# Altium project Atlas-V1.0.PrjPcb
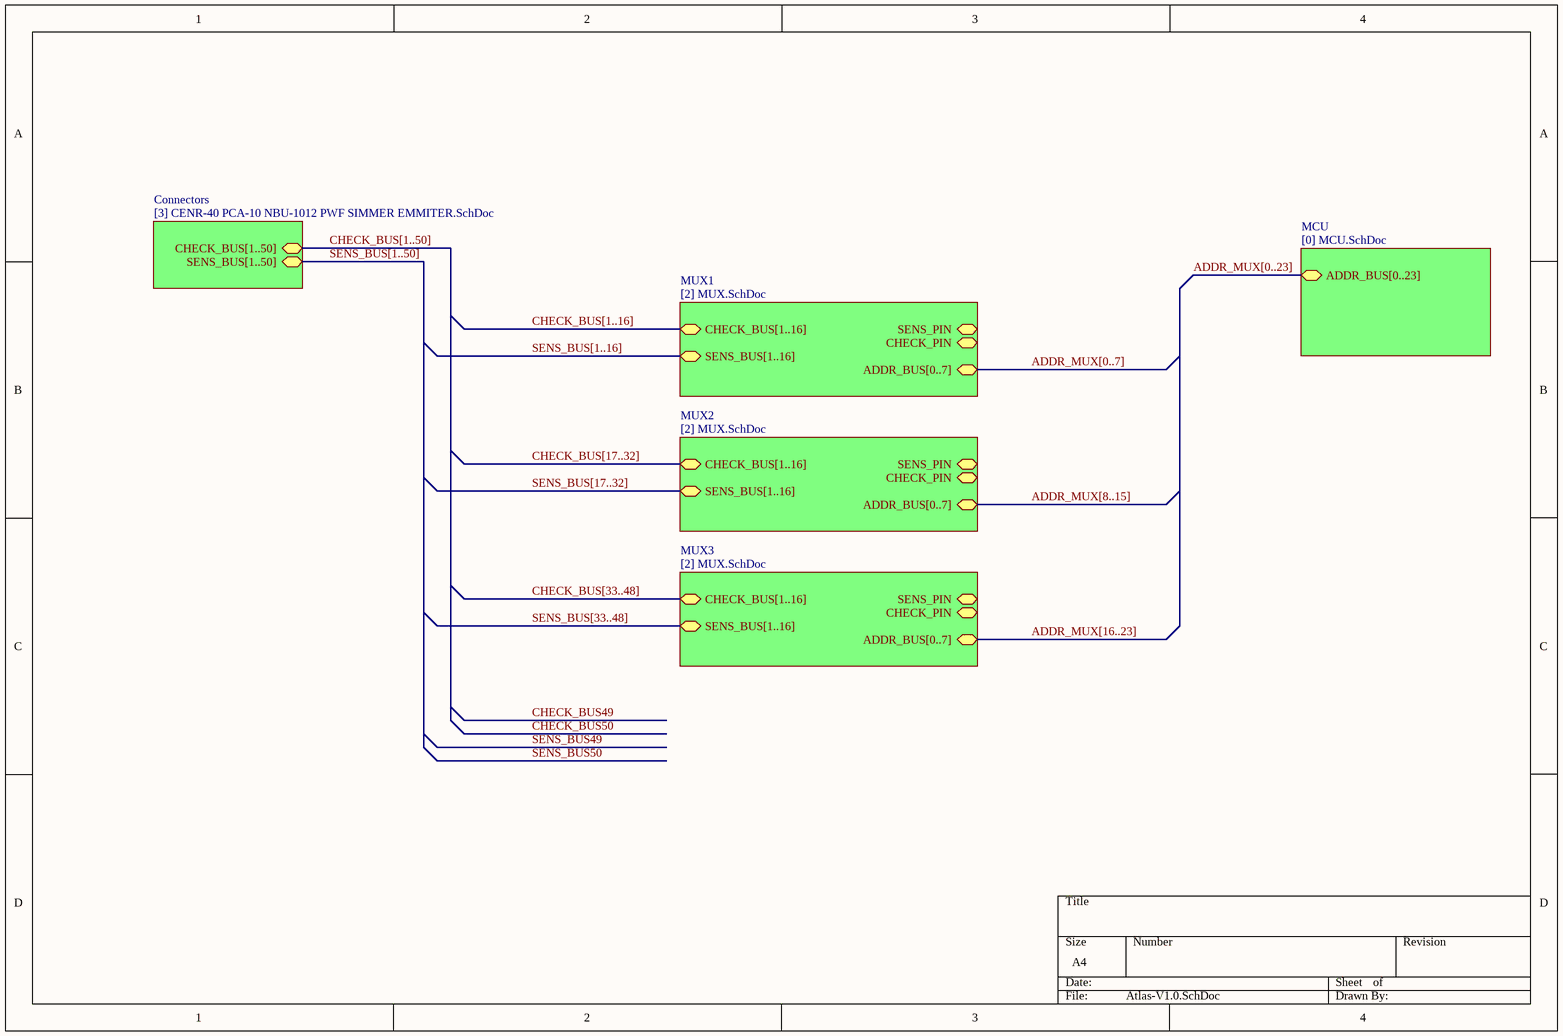
[diagram p0: Atlas-V1.0.SchDoc]
4 sheets, 19 parts. Net scope: hierarchical (ports join the sheet entries above them; power ports are global).
Board file: Atlas-PCB-V1.0.PcbDoc
Sheets:
  Atlas-V1.0.SchDoc
    Connectors = [3] CENR-40 PCA-10 NBU-1012 PWF SIMMER EMMITER.SchDoc
    MUX1 = [2] MUX.SchDoc
    MUX2 = [2] MUX.SchDoc
    MUX3 = [2] MUX.SchDoc
    MCU = [0] MCU.SchDoc

## Sheet Atlas-V1.0.SchDoc
size A4

### Sub-sheets
Connectors = [3] CENR-40 PCA-10 NBU-1012 PWF SIMMER EMMITER.SchDoc: CHECK_BUS[1..50], SENS_BUS[1..50]
MCU = [0] MCU.SchDoc: ADDR_BUS[0..23]
MUX1 = [2] MUX.SchDoc: SENS_BUS[1..16], CHECK_PIN, CHECK_BUS[1..16], SENS_PIN, ADDR_BUS[0..7]
MUX2 = [2] MUX.SchDoc: SENS_BUS[1..16], CHECK_PIN, CHECK_BUS[1..16], SENS_PIN, ADDR_BUS[0..7]
MUX3 = [2] MUX.SchDoc: SENS_BUS[1..16], CHECK_PIN, CHECK_BUS[1..16], SENS_PIN, ADDR_BUS[0..7]

### Buses and harness runs
bus ADDR_MUX[0..7] = sheet MUX1/ADDR_BUS[0..7]
bus ADDR_MUX[0..23] = sheet MCU/ADDR_BUS[0..23]
bus ADDR_MUX[8..15] = sheet MUX2/ADDR_BUS[0..7]
bus ADDR_MUX[16..23] = sheet MUX3/ADDR_BUS[0..7]
bus CHECK_BUS[1..16] = sheet MUX1/CHECK_BUS[1..16]
bus CHECK_BUS[1..50] = sheet Connectors/CHECK_BUS[1..50]
bus CHECK_BUS[17..32] = sheet MUX2/CHECK_BUS[1..16]
bus CHECK_BUS[33..48] = sheet MUX3/CHECK_BUS[1..16]
bus SENS_BUS[1..16] = sheet MUX1/SENS_BUS[1..16]
bus SENS_BUS[1..50] = sheet Connectors/SENS_BUS[1..50]
bus SENS_BUS[17..32] = sheet MUX2/SENS_BUS[1..16]
bus SENS_BUS[33..48] = sheet MUX3/SENS_BUS[1..16]

## Sheet [3] CENR-40 PCA-10 NBU-1012 PWF SIMMER EMMITER.SchDoc
size A4
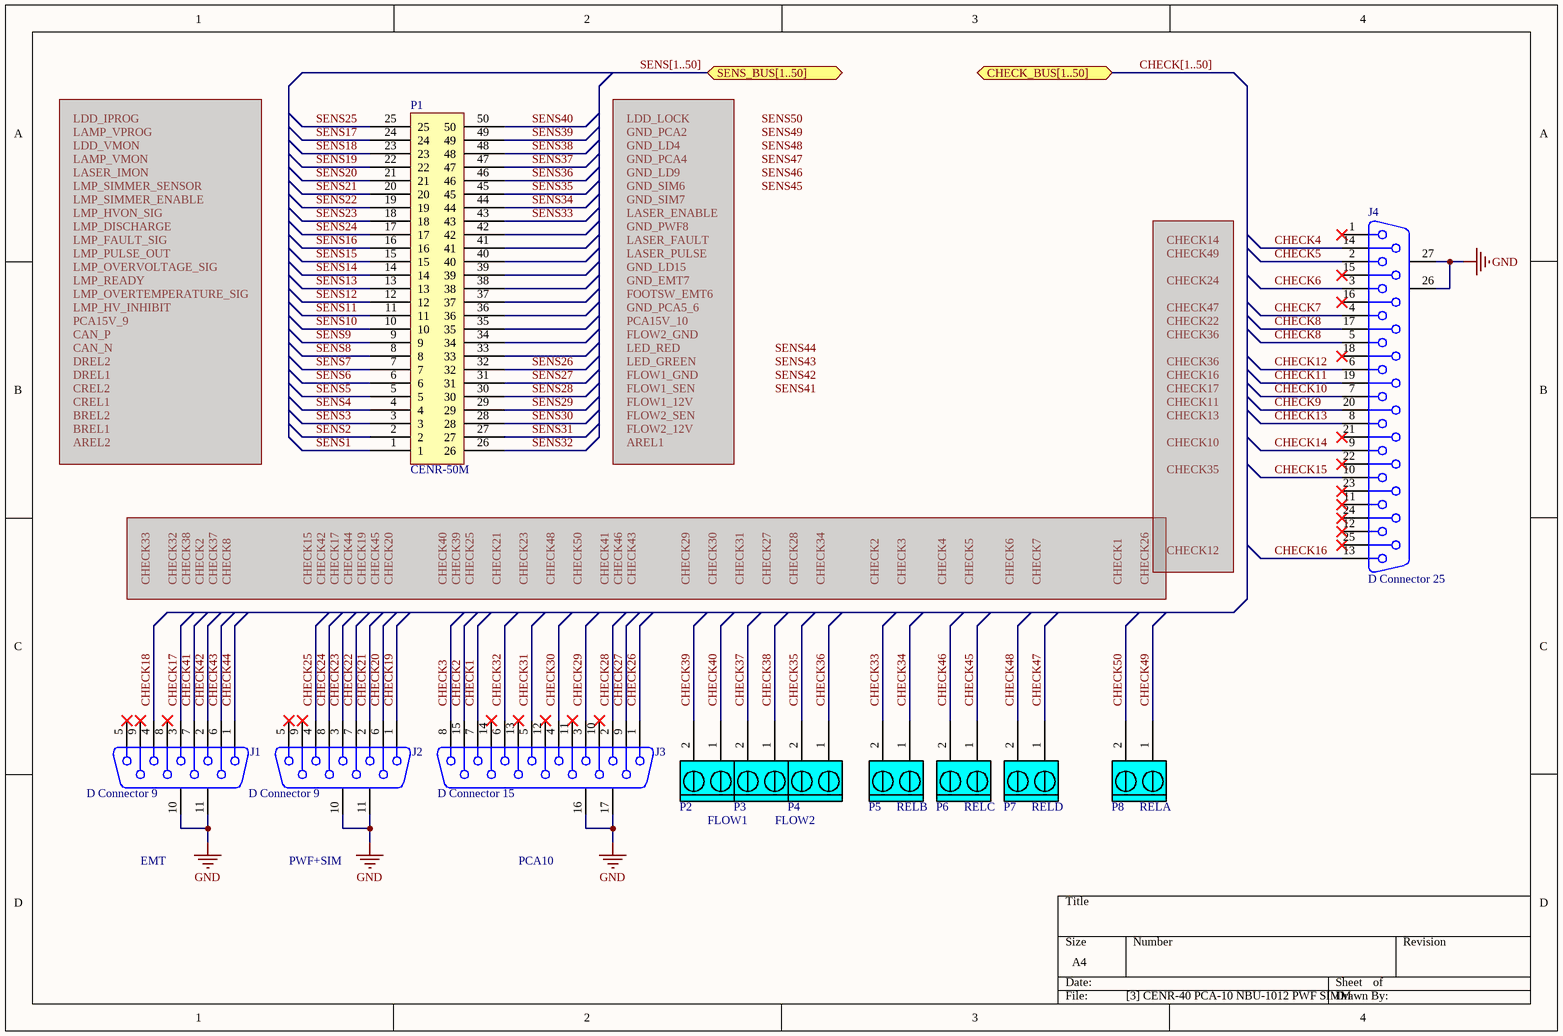
[diagram p1: [3] CENR-40 PCA-10 NBU-1012 PWF SIMMER EMMITER.SchDoc]

### Parts
J1  D Connector 9  [DSUB1.385-2H9F]
J2  D Connector 9  [DSUB1.385-2H9M]
J3  D Connector 15  [DSUB1.385-2H15M]
J4  D Connector 25  [DSUB1.385-2H25A-F]
P1  CENR-50M  [CENR-50M]
P2  DG340-3.81  [DG340-3.81-02P-00A(H)]  (value not drawn)
P3  DG340-3.81  [DG340-3.81-02P-00A(H)]  (value not drawn)
P4  DG340-3.81  [DG340-3.81-02P-00A(H)]  (value not drawn)
P5  DG340-3.81  [DG340-3.81-02P-00A(H)]  (value not drawn)
P6  DG340-3.81  [DG340-3.81-02P-00A(H)]  (value not drawn)
P7  DG340-3.81  [DG340-3.81-02P-00A(H)]  (value not drawn)
P8  DG340-3.81  [DG340-3.81-02P-00A(H)]  (value not drawn)

### Ports
CHECK_BUS[1..50], SENS_BUS[1..50]

### Nets
GND: J1.10(MH1) J1.11(MH2) J2.10(MH1) J2.11(MH2) J3.16(MH1) J3.17(MH2) J4.26(MH1) J4.27(MH2)
CHECK1: J3.7
CHECK2: J3.15
CHECK3: J3.8
CHECK4: J4.14
CHECK5: J4.2
CHECK6: J4.3
CHECK7: J4.4
CHECK8: J4.5 J4.17
CHECK9: J4.20
CHECK10: J4.7
CHECK11: J4.19
CHECK12: J4.6
CHECK13: J4.8
CHECK14: J4.9
CHECK15: J4.10
CHECK16: J4.13
CHECK17: J1.3  [project net CHECK1]
CHECK18: J1.4
CHECK19: J2.1
CHECK20: J2.6
CHECK21: J2.2
CHECK22: J2.7
CHECK23: J2.3
CHECK24: J2.8
CHECK25: J2.4
CHECK26: J3.1  [project net CHECK10]
CHECK27: J3.9  [project net CHECK11]
CHECK28: J3.2  [project net CHECK12]
CHECK29: J3.3  [project net CHECK13]
CHECK30: J3.4  [project net CHECK14]
CHECK31: J3.5  [project net CHECK15]
CHECK32: J3.6  [project net CHECK16]
CHECK33: P5.2  [project net CHECK1]
CHECK34: P5.1  [project net CHECK2]
CHECK35: P4.2  [project net CHECK3]
CHECK36: P4.1
CHECK37: P3.2
CHECK38: P3.1
CHECK39: P2.2
CHECK40: P2.1
CHECK41: J1.7
CHECK42: J1.2  [project net CHECK10]
CHECK43: J1.6  [project net CHECK11]
CHECK44: J1.1  [project net CHECK12]
CHECK45: P6.1  [project net CHECK13]
CHECK46: P6.2  [project net CHECK14]
CHECK47: P7.1  [project net CHECK15]
CHECK48: P7.2  [project net CHECK16]
CHECK49: P8.1
CHECK50: P8.2
SENS1: P1.1
SENS2: P1.2
SENS3: P1.3
SENS4: P1.4
SENS5: P1.5
SENS6: P1.6
SENS7: P1.7
SENS8: P1.8
SENS9: P1.9
SENS10: P1.10
SENS11: P1.11
SENS12: P1.12
SENS13: P1.13
SENS14: P1.14
SENS15: P1.15
SENS16: P1.16
SENS17: P1.24  [project net SENS1]
SENS18: P1.23
SENS19: P1.22
SENS20: P1.21
SENS21: P1.20
SENS22: P1.19
SENS23: P1.18
SENS24: P1.17
SENS25: P1.25
SENS26: P1.32  [project net SENS10]
SENS27: P1.31  [project net SENS11]
SENS28: P1.30  [project net SENS12]
SENS29: P1.29  [project net SENS13]
SENS30: P1.28  [project net SENS14]
SENS31: P1.27  [project net SENS15]
SENS32: P1.26  [project net SENS16]
SENS33: P1.43  [project net SENS1]
SENS34: P1.44  [project net SENS2]
SENS35: P1.45  [project net SENS3]
SENS36: P1.46
SENS37: P1.47
SENS38: P1.48
SENS39: P1.49
SENS40: P1.50

Not connected (* = marked no-connect by the designer): J1 5* 8* 9*; J2 5* 9*; J3 10* 11* 12* 13* 14*; J4 1* 11* 12* 15* 16* 18* 21* 22* 23* 24* 25*; P1 33 34 35 36 37 38 39 40 41 42

### Buses and harness runs
bus CHECK[1..50] = port CHECK_BUS[1..50]
bus SENS[1..50] = port SENS_BUS[1..50]

### Notes on the sheet
- FLOW1
- FLOW2
- RELB
- RELC
- (near P7) RELD
- (near P8) RELA
- EMT
- PWF+SIM
- PCA10
- Labels drawn without touching a wire or pin: SENS41, SENS42, SENS43, SENS44, SENS45, SENS46, SENS47, SENS48, SENS49, SENS50

### Library data of the parts
J1 J2 = D Connector 9: Receptacle Assembly, 9 Position, Right Angle; PackageDocument: O; Positions: 9; Published: 15-Jun-2001; LatestRevisionDate: 17-Jul-2002; LatestRevisionNote: Re-released for DXP Platform.; DatasheetDocument: 1-Sep-1999; PackageReference: 788750; Publisher: Altium Limited; Orientation: Right Angle; Gender: Receptacle
J3 = D Connector 15: Receptacle Assembly, 15 Position, Right Angle; PackageDocument: O; Positions: 15; Published: 15-Jun-2001; LatestRevisionDate: 17-Jul-2002; LatestRevisionNote: Re-released for DXP Platform.; DatasheetDocument: 1-Sep-99; PackageReference: 788757; Publisher: Altium Limited; Orientation: Right Angle; Gender: Receptacle
J4 = D Connector 25: Receptacle Assembly, 25 Position, Right Angle; PackageDocument: U; Positions: 25; Published: 15-Jun-2001; LatestRevisionDate: 17-Jul-2002; LatestRevisionNote: Re-released for DXP Platform.; DatasheetDocument: 19-Mar-1999; PackageReference: 787202; Publisher: Altium Limited; Orientation: Right Angle; Gender: Receptacle
P2-P8 = DG340-3.81-02P: Terminal block

## Sheet [2] MUX.SchDoc
size A4
Used 3 times, as channels MUX1, MUX2, MUX3. Parts and nets are listed once, with the designators drawn on the sheet.
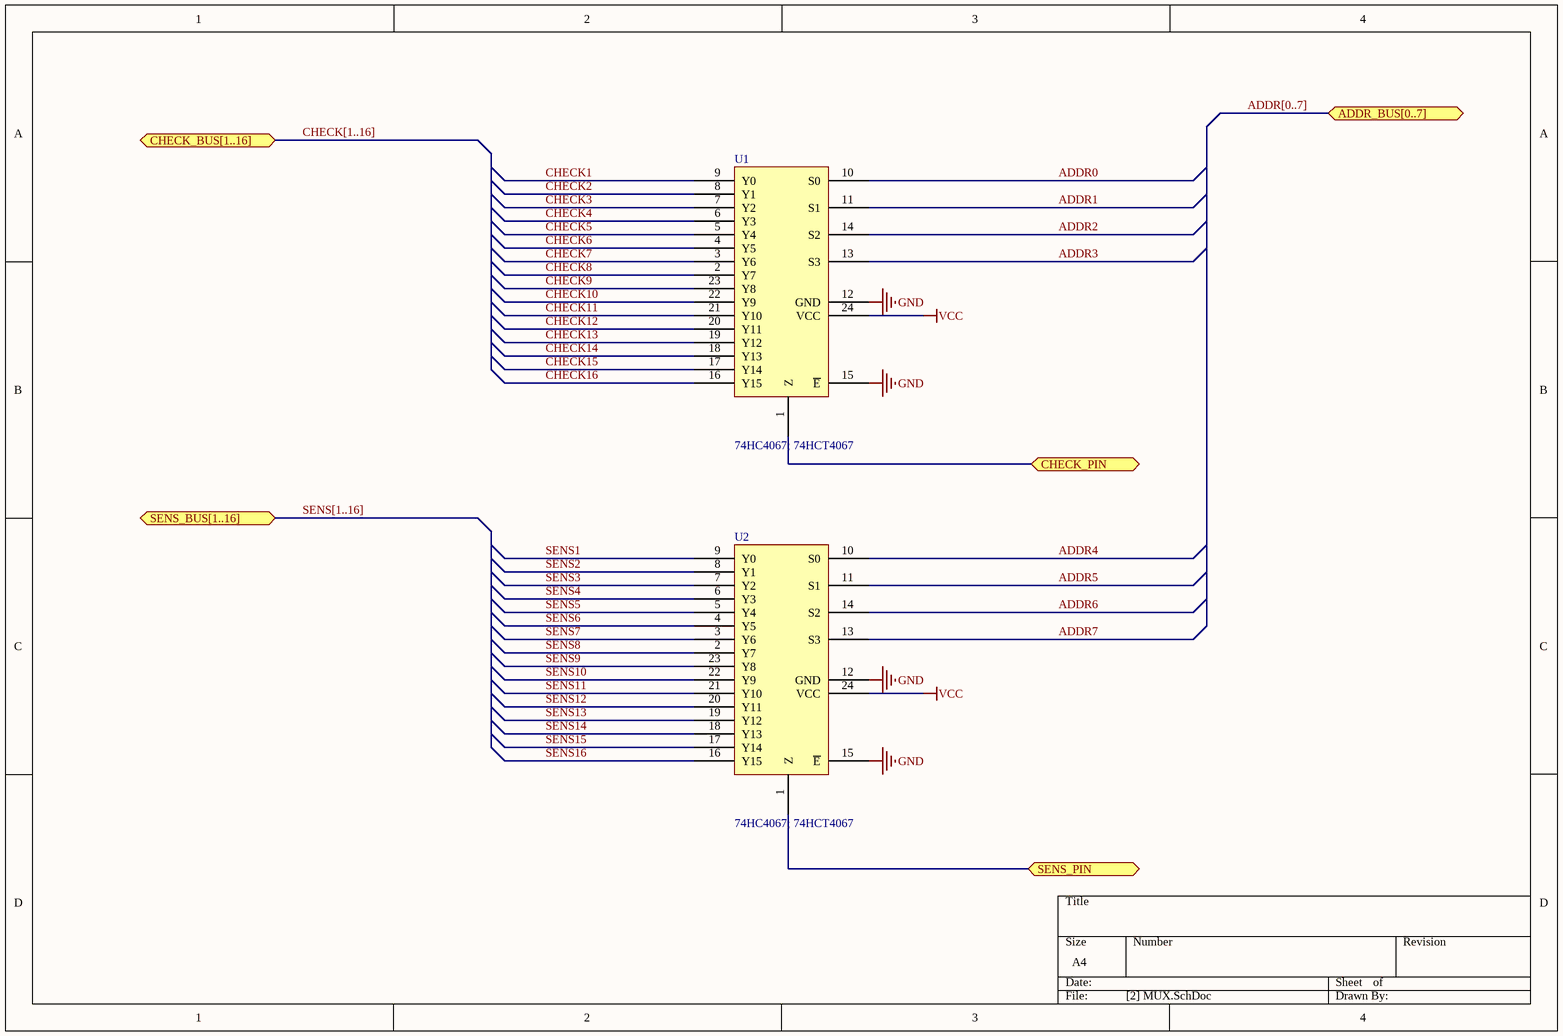
[diagram p2: [2] MUX.SchDoc]

### Parts
U1  74HC4067; 74HCT4067  [SO24]
U2  74HC4067; 74HCT4067  [SO24]

### Ports
ADDR_BUS[0..7], CHECK_BUS[1..16], CHECK_PIN, SENS_BUS[1..16], SENS_PIN

### Nets
GND: U1.12(GND) U1.15(~{E}) U2.12(GND) U2.15(~{E})
VCC: U1.24(VCC) U2.24(VCC)
ADDR0: U1.10(S0)
ADDR1: U1.11(S1)
ADDR2: U1.14(S2)
ADDR3: U1.13(S3)
ADDR4: U2.10(S0)
ADDR5: U2.11(S1)
ADDR6: U2.14(S2)
ADDR7: U2.13(S3)
CHECK1: U1.9(Y0)
CHECK2: U1.8(Y1)
CHECK3: U1.7(Y2)
CHECK4: U1.6(Y3)
CHECK5: U1.5(Y4)
CHECK6: U1.4(Y5)
CHECK7: U1.3(Y6)
CHECK8: U1.2(Y7)
CHECK9: U1.23(Y8)
CHECK10: U1.22(Y9)
CHECK11: U1.21(Y10)
CHECK12: U1.20(Y11)
CHECK13: U1.19(Y12)
CHECK14: U1.18(Y13)
CHECK15: U1.17(Y14)
CHECK16: U1.16(Y15)
CHECK_PIN: U1.1(Z) ; port CHECK_PIN
SENS1: U2.9(Y0)
SENS2: U2.8(Y1)
SENS3: U2.7(Y2)
SENS4: U2.6(Y3)
SENS5: U2.5(Y4)
SENS6: U2.4(Y5)
SENS7: U2.3(Y6)
SENS8: U2.2(Y7)
SENS9: U2.23(Y8)
SENS10: U2.22(Y9)
SENS11: U2.21(Y10)
SENS12: U2.20(Y11)
SENS13: U2.19(Y12)
SENS14: U2.18(Y13)
SENS15: U2.17(Y14)
SENS16: U2.16(Y15)
SENS_PIN: U2.1(Z) ; port SENS_PIN

### Channels
MUX1: designators end in _MUX1; ports CHECK_PIN=NetU1_MUX1_1 SENS_PIN=NetU2_MUX1_1
MUX2: designators end in _MUX2; ports CHECK_PIN=NetU1_MUX2_1 SENS_PIN=NetU2_MUX2_1
MUX3: designators end in _MUX3; ports CHECK_PIN=NetU1_MUX3_1 SENS_PIN=NetU2_MUX3_1

### Buses and harness runs
bus ADDR[0..7] = port ADDR_BUS[0..7]
bus CHECK[1..16] = port CHECK_BUS[1..16]
bus SENS[1..16] = port SENS_BUS[1..16]

### Library data of the parts
U1 U2 = 74HC4067; 74HCT4067: 16-channel analog multiplexer/demultiplexer

## Sheet [0] MCU.SchDoc
size A4
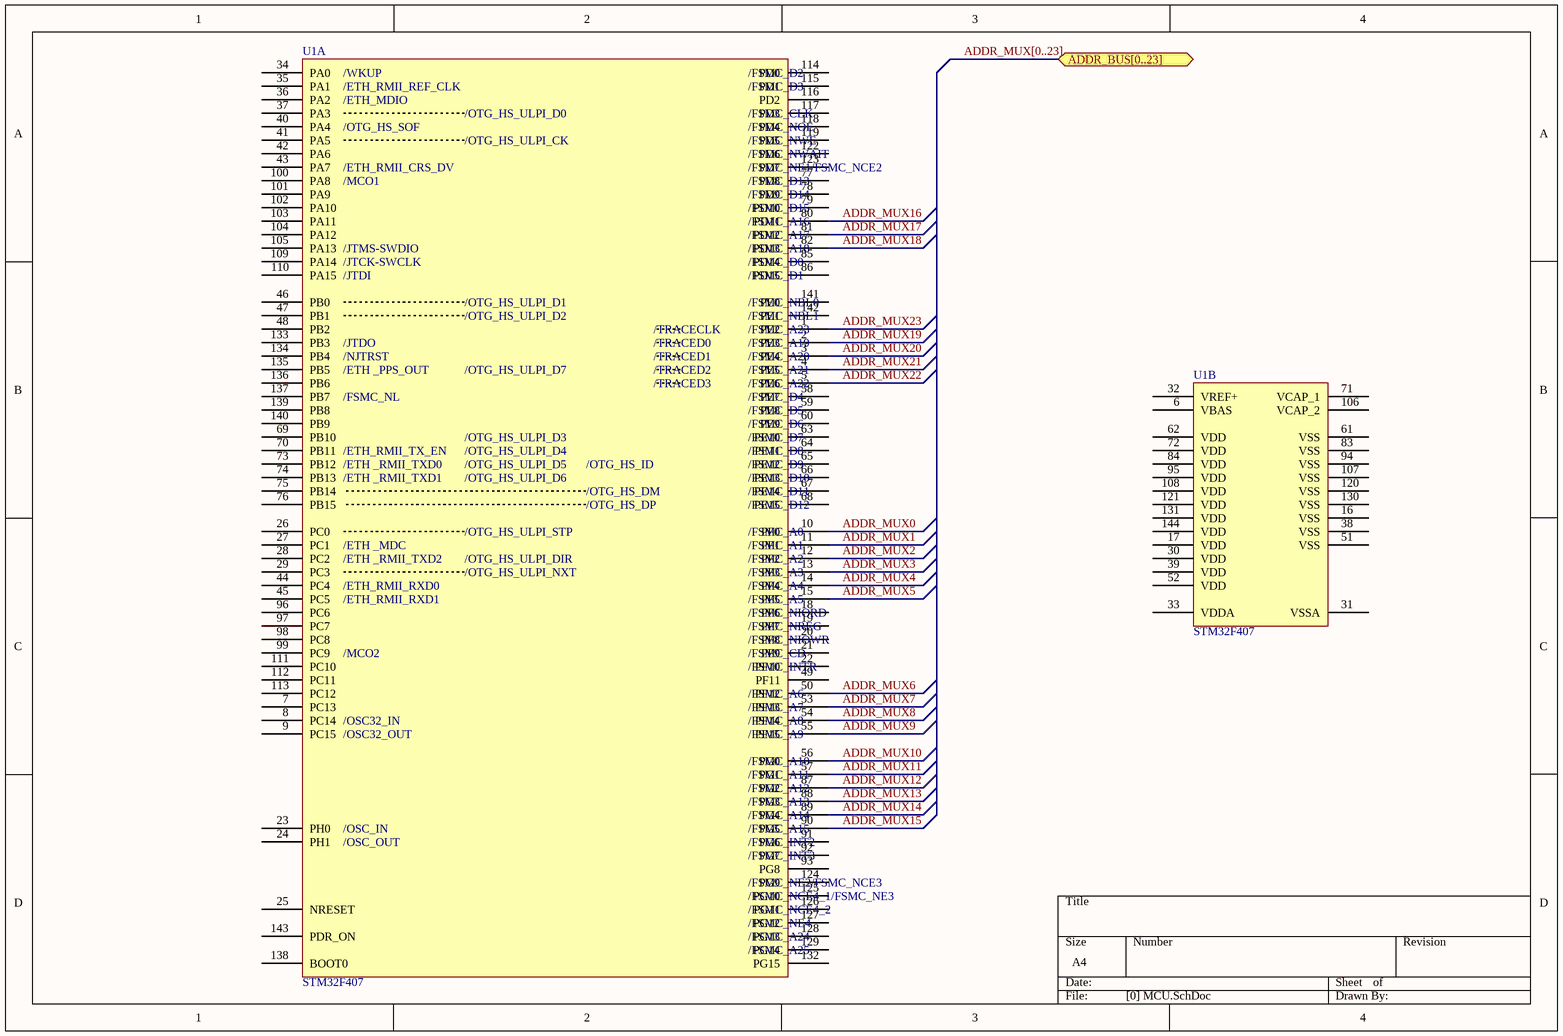
[diagram p3: [0] MCU.SchDoc]

### Parts
U1  STM32F407  [LQFP144]  (parts A,B of 2)

### Ports
ADDR_BUS[0..23]

### Nets
ADDR_MUX0: U1.10(PF0)  [project net ADDR0]
ADDR_MUX1: U1.11(PF1)  [project net ADDR1]
ADDR_MUX2: U1.12(PF2)  [project net ADDR2]
ADDR_MUX3: U1.13(PF3)  [project net ADDR3]
ADDR_MUX4: U1.14(PF4)  [project net ADDR4]
ADDR_MUX5: U1.15(PF5)  [project net ADDR5]
ADDR_MUX6: U1.50(PF12)  [project net ADDR6]
ADDR_MUX7: U1.53(PF13)  [project net ADDR7]
ADDR_MUX8: U1.54(PF14)  [project net ADDR0]
ADDR_MUX9: U1.55(PF15)  [project net ADDR1]
ADDR_MUX10: U1.56(PG0)  [project net ADDR2]
ADDR_MUX11: U1.57(PG1)  [project net ADDR3]
ADDR_MUX12: U1.87(PG2)  [project net ADDR4]
ADDR_MUX13: U1.88(PG3)  [project net ADDR5]
ADDR_MUX14: U1.89(PG4)  [project net ADDR6]
ADDR_MUX15: U1.90(PG5)  [project net ADDR7]
ADDR_MUX16: U1.80(PD11)  [project net ADDR0]
ADDR_MUX17: U1.81(PD12)  [project net ADDR1]
ADDR_MUX18: U1.82(PD13)  [project net ADDR2]
ADDR_MUX19: U1.2(PE3)  [project net ADDR3]
ADDR_MUX20: U1.3(PE4)  [project net ADDR4]
ADDR_MUX21: U1.4(PE5)  [project net ADDR5]
ADDR_MUX22: U1.5(PE6)  [project net ADDR6]
ADDR_MUX23: U1.1(PE2)  [project net ADDR7]

Not connected (* = marked no-connect by the designer): U1 6(VBAS) 7(PC13) 8(PC14) 9(PC15) 16(VSS) 17(VDD) 18(PF6) 19(PF7) 20(PF8) 21(PF9) 22(PF10) 23(PH0) 24(PH1) 25(NRESET) 26(PC0) 27(PC1) 28(PC2) 29(PC3) 30(VDD) 31(VSSA) 32(VREF+) 33(VDDA) 34(PA0) 35(PA1) 36(PA2) 37(PA3) 38(VSS) 39(VDD) 40(PA4) 41(PA5) 42(PA6) 43(PA7) 44(PC4) 45(PC5) 46(PB0) 47(PB1) 48(PB2) 49(PF11) 51(VSS) 52(VDD) 58(PE7) 59(PE8) 60(PE9) 61(VSS) 62(VDD) 63(PE10) 64(PE11) 65(PE12) 66(PE13) 67(PE14) 68(PE15) 69(PB10) 70(PB11) 71(VCAP_1) 72(VDD) 73(PB12) 74(PB13) 75(PB14) 76(PB15) 77(PD8) 78(PD9) 79(PD10) 83(VSS) 84(VDD) 85(PD14) 86(PD15) 91(PG6) 92(PG7) 93(PG8) 94(VSS) 95(VDD) 96(PC6) 97(PC7) 98(PC8) 99(PC9) 100(PA8) 101(PA9) 102(PA10) 103(PA11) 104(PA12) 105(PA13) 106(VCAP_2) 107(VSS) 108(VDD) 109(PA14) 110(PA15) 111(PC10) 112(PC11) 113(PC12) 114(PD0) 115(PD1) 116(PD2) 117(PD3) 118(PD4) 119(PD5) 120(VSS) 121(VDD) 122(PD6) 123(PD7) 124(PG9) 125(PG10) 126(PG11) 127(PG12) 128(PG13) 129(PG14) 130(VSS) 131(VDD) 132(PG15) 133(PB3) 134(PB4) 135(PB5) 136(PB6) 137(PB7) 138(BOOT0) 139(PB8) 140(PB9) 141(PE0) 142(PE1) 143(PDR_ON) 144(VDD)

### Buses and harness runs
bus ADDR_MUX[0..23] = port ADDR_BUS[0..23]

### Notes on the sheet
- (in symbol STM32F407ZGT6, part A) /WKUP; /FSMC_D2; /ETH_RMII_REF_CLK; /FSMC_D3; /ETH_MDIO; /OTG_HS_ULPI_D0; /FSMC_CLK; /OTG_HS_SOF; /FSMC_NOE; /OTG_HS_ULPI_CK; /FSMC_NWE; /FSMC_NWAIT; /ETH_RMII_CRS_DV; /FSMC_NE1/FSMC_NCE2; /MCO1; /FSMC_D13; /FSMC_D14; /FSMC_D15; /FSMC_A16; /FSMC_A17; /JTMS-SWDIO; /FSMC_A18; /JTCK-SWCLK; /FSMC_D0; /JTDI; /FSMC_D1; /OTG_HS_ULPI_D1; /FSMC_NBL0; /OTG_HS_ULPI_D2; /FSMC_NBL1; /TRACECLK; /FSMC_A23; /JTDO; /TRACED0; /FSMC_A19; /NJTRST; /TRACED1; /FSMC_A20; /ETH _PPS_OUT; /OTG_HS_ULPI_D7; /TRACED2; /FSMC_A21; /TRACED3; /FSMC_A22; /FSMC_NL; /FSMC_D4; /FSMC_D5; /FSMC_D6; /OTG_HS_ULPI_D3; /FSMC_D7; /ETH_RMII_TX_EN; /OTG_HS_ULPI_D4; /FSMC_D8; /ETH _RMII_TXD0; /OTG_HS_ULPI_D5; /OTG_HS_ID; /FSMC_D9; /ETH _RMII_TXD1; /OTG_HS_ULPI_D6; /FSMC_D10; /OTG_HS_DM; /FSMC_D11; /OTG_HS_DP; /FSMC_D12; /OTG_HS_ULPI_STP; /FSMC_A0; /ETH _MDC; /FSMC_A1; /ETH _RMII_TXD2; /OTG_HS_ULPI_DIR; /FSMC_A2; /OTG_HS_ULPI_NXT; /FSMC_A3; /ETH_RMII_RXD0; /FSMC_A4; /ETH_RMII_RXD1; /FSMC_A5; /FSMC_NIORD; /FSMC_NREG; /FSMC_NIOWR; /MCO2; /FSMC_CD; /FSMC_INTR; /FSMC_A6; /FSMC_A7; /OSC32_IN; /FSMC_A8; /OSC32_OUT; /FSMC_A9; /FSMC_A10; /FSMC_A11; /FSMC_A12; /FSMC_A13; /FSMC_A14; /OSC_IN; /FSMC_A15; /OSC_OUT; /FSMC_INT2; /FSMC_INT3; /FSMC_NE2/FSMC_NCE3; /FSMC_NCE4_1/FSMC_NE3; /FSMC_NCE4_2; /FSMC_NE4; /FSMC_A24; /FSMC_A25

### Library data of the parts
U1 = STM32F407ZGT6: ST Microcontroller ARM 32-bit Cortex M4

## Nets that join several sheets
GND: [3] CENR-40 PCA-10 NBU-1012 PWF SIMMER EMMITER (8 pins), MUX1 (U1_MUX1.12 U1_MUX1.15 U2_MUX1.12 U2_MUX1.15), MUX2 (U1_MUX2.12 U1_MUX2.15 U2_MUX2.12 U2_MUX2.15), MUX3 (U1_MUX3.12 U1_MUX3.15 U2_MUX3.12 U2_MUX3.15)
VCC: MUX1 (U1_MUX1.24 U2_MUX1.24), MUX2 (U1_MUX2.24 U2_MUX2.24), MUX3 (U1_MUX3.24 U2_MUX3.24)
ADDR0: MUX1 (U1_MUX1.10), [0] MCU (U1.10)
ADDR0: MUX2 (U1_MUX2.10), [0] MCU (U1.54)
ADDR0: MUX3 (U1_MUX3.10), [0] MCU (U1.80)
ADDR1: MUX1 (U1_MUX1.11), [0] MCU (U1.11)
ADDR1: MUX2 (U1_MUX2.11), [0] MCU (U1.55)
ADDR1: MUX3 (U1_MUX3.11), [0] MCU (U1.81)
ADDR2: MUX1 (U1_MUX1.14), [0] MCU (U1.12)
ADDR2: MUX2 (U1_MUX2.14), [0] MCU (U1.56)
ADDR2: MUX3 (U1_MUX3.14), [0] MCU (U1.82)
ADDR3: MUX1 (U1_MUX1.13), [0] MCU (U1.13)
ADDR3: MUX2 (U1_MUX2.13), [0] MCU (U1.57)
ADDR3: MUX3 (U1_MUX3.13), [0] MCU (U1.2)
ADDR4: MUX1 (U2_MUX1.10), [0] MCU (U1.14)
ADDR4: MUX2 (U2_MUX2.10), [0] MCU (U1.87)
ADDR4: MUX3 (U2_MUX3.10), [0] MCU (U1.3)
ADDR5: MUX1 (U2_MUX1.11), [0] MCU (U1.15)
ADDR5: MUX2 (U2_MUX2.11), [0] MCU (U1.88)
ADDR5: MUX3 (U2_MUX3.11), [0] MCU (U1.4)
ADDR6: MUX1 (U2_MUX1.14), [0] MCU (U1.50)
ADDR6: MUX2 (U2_MUX2.14), [0] MCU (U1.89)
ADDR6: MUX3 (U2_MUX3.14), [0] MCU (U1.5)
ADDR7: MUX1 (U2_MUX1.13), [0] MCU (U1.53)
ADDR7: MUX2 (U2_MUX2.13), [0] MCU (U1.90)
ADDR7: MUX3 (U2_MUX3.13), [0] MCU (U1.1)
CHECK1: [3] CENR-40 PCA-10 NBU-1012 PWF SIMMER EMMITER (J1.3), MUX2 (U1_MUX2.9)
CHECK1: [3] CENR-40 PCA-10 NBU-1012 PWF SIMMER EMMITER (J3.7), MUX1 (U1_MUX1.9)
CHECK1: [3] CENR-40 PCA-10 NBU-1012 PWF SIMMER EMMITER (P5.2), MUX3 (U1_MUX3.9)
CHECK2: [3] CENR-40 PCA-10 NBU-1012 PWF SIMMER EMMITER (J3.15), MUX1 (U1_MUX1.8)
CHECK2: [3] CENR-40 PCA-10 NBU-1012 PWF SIMMER EMMITER (P5.1), MUX3 (U1_MUX3.8)
CHECK3: [3] CENR-40 PCA-10 NBU-1012 PWF SIMMER EMMITER (J3.8), MUX1 (U1_MUX1.7)
CHECK3: [3] CENR-40 PCA-10 NBU-1012 PWF SIMMER EMMITER (P4.2), MUX3 (U1_MUX3.7)
CHECK4: [3] CENR-40 PCA-10 NBU-1012 PWF SIMMER EMMITER (J4.14), MUX1 (U1_MUX1.6)
CHECK5: [3] CENR-40 PCA-10 NBU-1012 PWF SIMMER EMMITER (J4.2), MUX1 (U1_MUX1.5)
CHECK6: [3] CENR-40 PCA-10 NBU-1012 PWF SIMMER EMMITER (J4.3), MUX1 (U1_MUX1.4)
CHECK7: [3] CENR-40 PCA-10 NBU-1012 PWF SIMMER EMMITER (J4.4), MUX1 (U1_MUX1.3)
CHECK8: [3] CENR-40 PCA-10 NBU-1012 PWF SIMMER EMMITER (J4.5 J4.17), MUX1 (U1_MUX1.2)
CHECK9: [3] CENR-40 PCA-10 NBU-1012 PWF SIMMER EMMITER (J4.20), MUX1 (U1_MUX1.23)
CHECK10: [3] CENR-40 PCA-10 NBU-1012 PWF SIMMER EMMITER (J4.7), MUX1 (U1_MUX1.22)
CHECK10: [3] CENR-40 PCA-10 NBU-1012 PWF SIMMER EMMITER (J1.2), MUX3 (U1_MUX3.22)
CHECK10: [3] CENR-40 PCA-10 NBU-1012 PWF SIMMER EMMITER (J3.1), MUX2 (U1_MUX2.22)
CHECK11: [3] CENR-40 PCA-10 NBU-1012 PWF SIMMER EMMITER (J4.19), MUX1 (U1_MUX1.21)
CHECK11: [3] CENR-40 PCA-10 NBU-1012 PWF SIMMER EMMITER (J1.6), MUX3 (U1_MUX3.21)
CHECK11: [3] CENR-40 PCA-10 NBU-1012 PWF SIMMER EMMITER (J3.9), MUX2 (U1_MUX2.21)
CHECK12: [3] CENR-40 PCA-10 NBU-1012 PWF SIMMER EMMITER (J4.6), MUX1 (U1_MUX1.20)
CHECK12: [3] CENR-40 PCA-10 NBU-1012 PWF SIMMER EMMITER (J1.1), MUX3 (U1_MUX3.20)
CHECK12: [3] CENR-40 PCA-10 NBU-1012 PWF SIMMER EMMITER (J3.2), MUX2 (U1_MUX2.20)
CHECK13: [3] CENR-40 PCA-10 NBU-1012 PWF SIMMER EMMITER (J4.8), MUX1 (U1_MUX1.19)
CHECK13: [3] CENR-40 PCA-10 NBU-1012 PWF SIMMER EMMITER (J3.3), MUX2 (U1_MUX2.19)
CHECK13: [3] CENR-40 PCA-10 NBU-1012 PWF SIMMER EMMITER (P6.1), MUX3 (U1_MUX3.19)
CHECK14: [3] CENR-40 PCA-10 NBU-1012 PWF SIMMER EMMITER (J4.9), MUX1 (U1_MUX1.18)
CHECK14: [3] CENR-40 PCA-10 NBU-1012 PWF SIMMER EMMITER (J3.4), MUX2 (U1_MUX2.18)
CHECK14: [3] CENR-40 PCA-10 NBU-1012 PWF SIMMER EMMITER (P6.2), MUX3 (U1_MUX3.18)
CHECK15: [3] CENR-40 PCA-10 NBU-1012 PWF SIMMER EMMITER (J4.10), MUX1 (U1_MUX1.17)
CHECK15: [3] CENR-40 PCA-10 NBU-1012 PWF SIMMER EMMITER (J3.5), MUX2 (U1_MUX2.17)
CHECK15: [3] CENR-40 PCA-10 NBU-1012 PWF SIMMER EMMITER (P7.1), MUX3 (U1_MUX3.17)
CHECK16: [3] CENR-40 PCA-10 NBU-1012 PWF SIMMER EMMITER (J4.13), MUX1 (U1_MUX1.16)
CHECK16: [3] CENR-40 PCA-10 NBU-1012 PWF SIMMER EMMITER (J3.6), MUX2 (U1_MUX2.16)
CHECK16: [3] CENR-40 PCA-10 NBU-1012 PWF SIMMER EMMITER (P7.2), MUX3 (U1_MUX3.16)
CHECK18: [3] CENR-40 PCA-10 NBU-1012 PWF SIMMER EMMITER (J1.4), MUX2 (U1_MUX2.8)
CHECK19: [3] CENR-40 PCA-10 NBU-1012 PWF SIMMER EMMITER (J2.1), MUX2 (U1_MUX2.7)
CHECK20: [3] CENR-40 PCA-10 NBU-1012 PWF SIMMER EMMITER (J2.6), MUX2 (U1_MUX2.6)
CHECK21: [3] CENR-40 PCA-10 NBU-1012 PWF SIMMER EMMITER (J2.2), MUX2 (U1_MUX2.5)
CHECK22: [3] CENR-40 PCA-10 NBU-1012 PWF SIMMER EMMITER (J2.7), MUX2 (U1_MUX2.4)
CHECK23: [3] CENR-40 PCA-10 NBU-1012 PWF SIMMER EMMITER (J2.3), MUX2 (U1_MUX2.3)
CHECK24: [3] CENR-40 PCA-10 NBU-1012 PWF SIMMER EMMITER (J2.8), MUX2 (U1_MUX2.2)
CHECK25: [3] CENR-40 PCA-10 NBU-1012 PWF SIMMER EMMITER (J2.4), MUX2 (U1_MUX2.23)
CHECK36: [3] CENR-40 PCA-10 NBU-1012 PWF SIMMER EMMITER (P4.1), MUX3 (U1_MUX3.6)
CHECK37: [3] CENR-40 PCA-10 NBU-1012 PWF SIMMER EMMITER (P3.2), MUX3 (U1_MUX3.5)
CHECK38: [3] CENR-40 PCA-10 NBU-1012 PWF SIMMER EMMITER (P3.1), MUX3 (U1_MUX3.4)
CHECK39: [3] CENR-40 PCA-10 NBU-1012 PWF SIMMER EMMITER (P2.2), MUX3 (U1_MUX3.3)
CHECK40: [3] CENR-40 PCA-10 NBU-1012 PWF SIMMER EMMITER (P2.1), MUX3 (U1_MUX3.2)
CHECK41: [3] CENR-40 PCA-10 NBU-1012 PWF SIMMER EMMITER (J1.7), MUX3 (U1_MUX3.23)
SENS1: [3] CENR-40 PCA-10 NBU-1012 PWF SIMMER EMMITER (P1.1), MUX1 (U2_MUX1.9)
SENS1: [3] CENR-40 PCA-10 NBU-1012 PWF SIMMER EMMITER (P1.24), MUX2 (U2_MUX2.9)
SENS1: [3] CENR-40 PCA-10 NBU-1012 PWF SIMMER EMMITER (P1.43), MUX3 (U2_MUX3.9)
SENS2: [3] CENR-40 PCA-10 NBU-1012 PWF SIMMER EMMITER (P1.2), MUX1 (U2_MUX1.8)
SENS2: [3] CENR-40 PCA-10 NBU-1012 PWF SIMMER EMMITER (P1.44), MUX3 (U2_MUX3.8)
SENS3: [3] CENR-40 PCA-10 NBU-1012 PWF SIMMER EMMITER (P1.3), MUX1 (U2_MUX1.7)
SENS3: [3] CENR-40 PCA-10 NBU-1012 PWF SIMMER EMMITER (P1.45), MUX3 (U2_MUX3.7)
SENS4: [3] CENR-40 PCA-10 NBU-1012 PWF SIMMER EMMITER (P1.4), MUX1 (U2_MUX1.6)
SENS5: [3] CENR-40 PCA-10 NBU-1012 PWF SIMMER EMMITER (P1.5), MUX1 (U2_MUX1.5)
SENS6: [3] CENR-40 PCA-10 NBU-1012 PWF SIMMER EMMITER (P1.6), MUX1 (U2_MUX1.4)
SENS7: [3] CENR-40 PCA-10 NBU-1012 PWF SIMMER EMMITER (P1.7), MUX1 (U2_MUX1.3)
SENS8: [3] CENR-40 PCA-10 NBU-1012 PWF SIMMER EMMITER (P1.8), MUX1 (U2_MUX1.2)
SENS9: [3] CENR-40 PCA-10 NBU-1012 PWF SIMMER EMMITER (P1.9), MUX1 (U2_MUX1.23)
SENS10: [3] CENR-40 PCA-10 NBU-1012 PWF SIMMER EMMITER (P1.10), MUX1 (U2_MUX1.22)
SENS10: [3] CENR-40 PCA-10 NBU-1012 PWF SIMMER EMMITER (P1.32), MUX2 (U2_MUX2.22)
SENS11: [3] CENR-40 PCA-10 NBU-1012 PWF SIMMER EMMITER (P1.11), MUX1 (U2_MUX1.21)
SENS11: [3] CENR-40 PCA-10 NBU-1012 PWF SIMMER EMMITER (P1.31), MUX2 (U2_MUX2.21)
SENS12: [3] CENR-40 PCA-10 NBU-1012 PWF SIMMER EMMITER (P1.12), MUX1 (U2_MUX1.20)
SENS12: [3] CENR-40 PCA-10 NBU-1012 PWF SIMMER EMMITER (P1.30), MUX2 (U2_MUX2.20)
SENS13: [3] CENR-40 PCA-10 NBU-1012 PWF SIMMER EMMITER (P1.13), MUX1 (U2_MUX1.19)
SENS13: [3] CENR-40 PCA-10 NBU-1012 PWF SIMMER EMMITER (P1.29), MUX2 (U2_MUX2.19)
SENS14: [3] CENR-40 PCA-10 NBU-1012 PWF SIMMER EMMITER (P1.14), MUX1 (U2_MUX1.18)
SENS14: [3] CENR-40 PCA-10 NBU-1012 PWF SIMMER EMMITER (P1.28), MUX2 (U2_MUX2.18)
SENS15: [3] CENR-40 PCA-10 NBU-1012 PWF SIMMER EMMITER (P1.15), MUX1 (U2_MUX1.17)
SENS15: [3] CENR-40 PCA-10 NBU-1012 PWF SIMMER EMMITER (P1.27), MUX2 (U2_MUX2.17)
SENS16: [3] CENR-40 PCA-10 NBU-1012 PWF SIMMER EMMITER (P1.16), MUX1 (U2_MUX1.16)
SENS16: [3] CENR-40 PCA-10 NBU-1012 PWF SIMMER EMMITER (P1.26), MUX2 (U2_MUX2.16)
SENS18: [3] CENR-40 PCA-10 NBU-1012 PWF SIMMER EMMITER (P1.23), MUX2 (U2_MUX2.8)
SENS19: [3] CENR-40 PCA-10 NBU-1012 PWF SIMMER EMMITER (P1.22), MUX2 (U2_MUX2.7)
SENS20: [3] CENR-40 PCA-10 NBU-1012 PWF SIMMER EMMITER (P1.21), MUX2 (U2_MUX2.6)
SENS21: [3] CENR-40 PCA-10 NBU-1012 PWF SIMMER EMMITER (P1.20), MUX2 (U2_MUX2.5)
SENS22: [3] CENR-40 PCA-10 NBU-1012 PWF SIMMER EMMITER (P1.19), MUX2 (U2_MUX2.4)
SENS23: [3] CENR-40 PCA-10 NBU-1012 PWF SIMMER EMMITER (P1.18), MUX2 (U2_MUX2.3)
SENS24: [3] CENR-40 PCA-10 NBU-1012 PWF SIMMER EMMITER (P1.17), MUX2 (U2_MUX2.2)
SENS25: [3] CENR-40 PCA-10 NBU-1012 PWF SIMMER EMMITER (P1.25), MUX2 (U2_MUX2.23)
SENS36: [3] CENR-40 PCA-10 NBU-1012 PWF SIMMER EMMITER (P1.46), MUX3 (U2_MUX3.6)
SENS37: [3] CENR-40 PCA-10 NBU-1012 PWF SIMMER EMMITER (P1.47), MUX3 (U2_MUX3.5)
SENS38: [3] CENR-40 PCA-10 NBU-1012 PWF SIMMER EMMITER (P1.48), MUX3 (U2_MUX3.4)
SENS39: [3] CENR-40 PCA-10 NBU-1012 PWF SIMMER EMMITER (P1.49), MUX3 (U2_MUX3.3)
SENS40: [3] CENR-40 PCA-10 NBU-1012 PWF SIMMER EMMITER (P1.50), MUX3 (U2_MUX3.2)